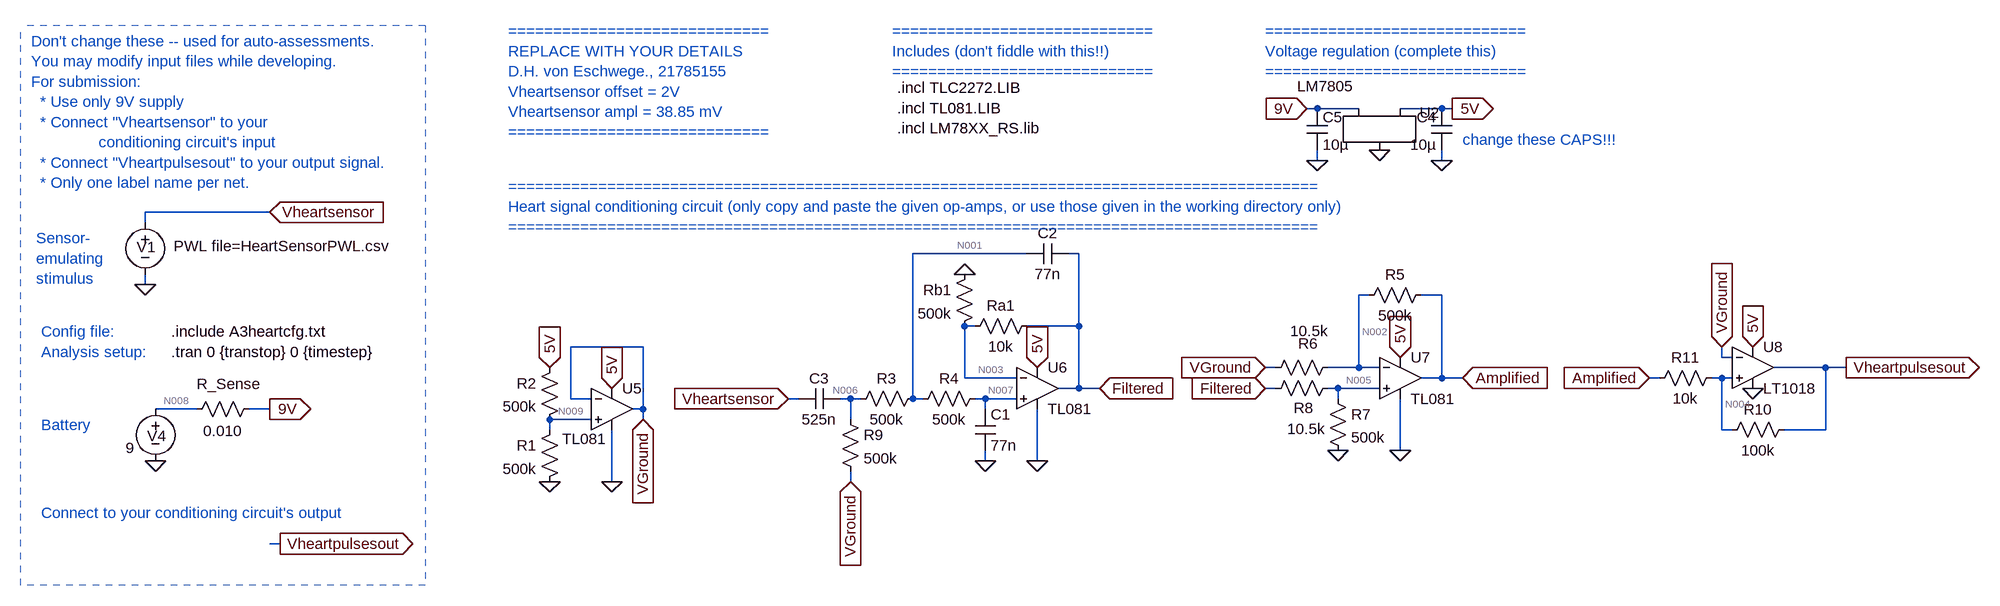
[diagram p0: schematic E344_A3_heart.asc]
E344_A3_heart.asc, the LTspice schematic file:
Version 4
SHEET 1 1824 680
WIRE -304 -1280 -320 -1280
WIRE -240 -1280 -304 -1280
WIRE -112 -1280 -176 -1280
WIRE -96 -1280 -112 -1280
WIRE -304 -1200 -304 -1216
WIRE -112 -1200 -112 -1216
WIRE -1920 -1120 -2112 -1120
WIRE -2112 -1104 -2112 -1120
WIRE -752 -1056 -928 -1056
WIRE -672 -1056 -688 -1056
WIRE -2112 -1008 -2112 -1024
WIRE -224 -992 -240 -992
WIRE -112 -992 -144 -992
WIRE -832 -944 -848 -944
WIRE -672 -944 -672 -1056
WIRE -672 -944 -752 -944
WIRE -1344 -912 -1456 -912
WIRE 320 -896 320 -912
WIRE 336 -896 320 -896
WIRE -368 -880 -384 -880
WIRE -240 -880 -240 -992
WIRE -240 -880 -288 -880
WIRE -208 -880 -240 -880
WIRE 480 -880 400 -880
WIRE 512 -880 480 -880
WIRE -848 -864 -848 -944
WIRE -768 -864 -848 -864
WIRE -112 -864 -112 -992
WIRE -112 -864 -144 -864
WIRE -80 -864 -112 -864
WIRE 224 -864 208 -864
WIRE 320 -864 304 -864
WIRE 336 -864 320 -864
WIRE -672 -848 -672 -944
WIRE -672 -848 -704 -848
WIRE -640 -848 -672 -848
WIRE -368 -848 -384 -848
WIRE -272 -848 -288 -848
WIRE -208 -848 -272 -848
WIRE -1456 -832 -1456 -912
WIRE -1424 -832 -1456 -832
WIRE -1104 -832 -1120 -832
WIRE -1024 -832 -1040 -832
WIRE -1008 -832 -1024 -832
WIRE -928 -832 -928 -1056
WIRE -912 -832 -928 -832
WIRE -816 -832 -832 -832
WIRE -768 -832 -816 -832
WIRE -272 -832 -272 -848
WIRE -2032 -816 -2096 -816
WIRE -1920 -816 -1952 -816
WIRE -1344 -816 -1344 -912
WIRE -1344 -816 -1360 -816
WIRE -816 -816 -816 -832
WIRE -1424 -800 -1488 -800
WIRE -1344 -800 -1344 -816
WIRE -1024 -800 -1024 -832
WIRE -1488 -784 -1488 -800
WIRE 320 -784 320 -864
WIRE 336 -784 320 -784
WIRE 480 -784 480 -880
WIRE 480 -784 416 -784
WIRE -176 -752 -176 -832
WIRE -816 -736 -816 -752
WIRE -736 -736 -736 -816
WIRE -1392 -704 -1392 -784
WIRE -1024 -704 -1024 -720
WIRE -1904 -608 -1920 -608
FLAG -2112 -1008 0
FLAG -1920 -1120 Vheartsensor
IOPIN -1920 -1120 In
FLAG -1920 -816 9V
IOPIN -1920 -816 Out
FLAG -2096 -736 0
FLAG -1904 -608 Vheartpulsesout
IOPIN -1904 -608 Out
FLAG -1488 -704 0
FLAG -1488 -880 5V
IOPIN -1488 -880 In
FLAG -1392 -704 0
FLAG -1392 -848 5V
IOPIN -1392 -848 In
FLAG -1344 -800 VGround
IOPIN -1344 -800 In
FLAG -736 -736 0
FLAG -816 -736 0
FLAG -848 -1024 0
FLAG -736 -880 5V
IOPIN -736 -880 In
FLAG -176 -752 0
FLAG -272 -752 0
FLAG -176 -896 5V
IOPIN -176 -896 In
FLAG 368 -912 5V
IOPIN 368 -912 In
FLAG 368 -848 0
FLAG -1024 -704 VGround
IOPIN -1024 -704 In
FLAG -640 -848 Filtered
IOPIN -640 -848 In
FLAG -384 -848 Filtered
IOPIN -384 -848 In
FLAG -80 -864 Amplified
IOPIN -80 -864 In
FLAG 208 -864 Amplified
IOPIN 208 -864 In
FLAG -384 -880 VGround
IOPIN -384 -880 In
FLAG 320 -912 VGround
IOPIN 320 -912 In
FLAG 512 -880 Vheartpulsesout
IOPIN 512 -880 Out
FLAG -320 -1280 9V
IOPIN -320 -1280 In
FLAG -208 -1216 0
FLAG -96 -1280 5V
IOPIN -96 -1280 Out
FLAG -304 -1200 0
FLAG -112 -1200 0
FLAG -1120 -832 Vheartsensor
IOPIN -1120 -832 In
SYMBOL voltage -2112 -1120 R0
WINDOW 123 0 0 Left 0
WINDOW 39 0 0 Left 0
WINDOW 3 44 52 Left 2
WINDOW 0 -13 54 Left 2
SYMATTR Value PWL file=HeartSensorPWL.csv
SYMATTR InstName V1
SYMBOL voltage -2096 -832 R0
WINDOW 123 24 44 Left 2
WINDOW 39 0 0 Left 0
WINDOW 3 -46 76 Left 2
WINDOW 0 -13 57 Left 2
SYMATTR Value 9
SYMATTR InstName V4
SYMBOL res -1936 -832 R90
WINDOW 0 -7 47 VBottom 2
WINDOW 3 34 56 VTop 2
SYMATTR InstName R_Sense
SYMATTR Value 0.010
SYMBOL res -1472 -800 M0
SYMATTR InstName R1
SYMATTR Value 500k
SYMBOL res -1472 -896 M0
SYMATTR InstName R2
SYMATTR Value 500k
SYMBOL res -912 -848 R90
WINDOW 0 0 56 VBottom 2
WINDOW 3 32 56 VTop 2
SYMATTR InstName R3
SYMATTR Value 500k
SYMBOL cap -832 -816 R0
SYMATTR InstName C1
SYMATTR Value 77n
SYMBOL res -816 -848 R90
WINDOW 0 0 56 VBottom 2
WINDOW 3 32 56 VTop 2
SYMATTR InstName R4
SYMATTR Value 500k
SYMBOL res -736 -960 R90
WINDOW 0 0 56 VBottom 2
WINDOW 3 32 56 VTop 2
SYMATTR InstName Ra1
SYMATTR Value 10k
SYMBOL res -832 -1040 M0
SYMATTR InstName Rb1
SYMATTR Value 500k
SYMBOL cap -688 -1072 R90
WINDOW 0 0 32 VBottom 2
WINDOW 3 32 32 VTop 2
SYMATTR InstName C2
SYMATTR Value 77n
SYMBOL res -128 -1008 R90
WINDOW 0 0 56 VBottom 2
WINDOW 3 32 56 VTop 2
SYMATTR InstName R5
SYMATTR Value 500k
SYMBOL res -272 -896 R90
WINDOW 0 -6 46 VBottom 2
WINDOW 3 -56 44 VTop 2
SYMATTR InstName R6
SYMATTR Value 10.5k
SYMBOL res -288 -848 R0
SYMATTR InstName R7
SYMATTR Value 500k
SYMBOL res -272 -864 R90
WINDOW 0 62 53 VBottom 2
WINDOW 3 63 49 VTop 2
SYMATTR InstName R8
SYMATTR Value 10.5k
SYMBOL cap -1040 -816 M270
WINDOW 0 32 32 VTop 2
WINDOW 3 0 32 VBottom 2
SYMATTR InstName C3
SYMATTR Value 525n
SYMBOL res -1040 -816 R0
SYMATTR InstName R9
SYMATTR Value 500k
SYMBOL res 432 -800 R90
WINDOW 0 0 56 VBottom 2
WINDOW 3 32 56 VTop 2
SYMATTR InstName R10
SYMATTR Value 100k
SYMBOL res 320 -880 R90
WINDOW 0 0 56 VBottom 2
WINDOW 3 32 56 VTop 2
SYMATTR InstName R11
SYMATTR Value 10k
SYMBOL opamp2 -736 -912 R0
SYMATTR InstName U6
SYMATTR Value TL081
SYMATTR SpiceModel TL081
SYMBOL opamp2 -176 -928 R0
SYMATTR InstName U7
SYMATTR Value TL081
SYMATTR SpiceModel TL081
SYMBOL LT1018 368 -880 R0
SYMATTR InstName U8
SYMBOL opamp2 -1392 -880 R0
WINDOW 3 -77 110 Left 2
SYMATTR Value TL081
SYMATTR InstName U5
SYMATTR SpiceModel TL081
SYMBOL LM7805 -208 -1264 R0
WINDOW 3 -83 -66 Top 2
SYMATTR InstName U2
SYMBOL cap -96 -1280 M0
WINDOW 0 24 13 Left 2
SYMATTR InstName C4
SYMATTR Value 10µ
SYMBOL cap -320 -1280 R0
WINDOW 0 24 13 Left 2
SYMATTR InstName C5
SYMATTR Value 10µ
TEXT -2072 -904 Left 2 !.tran 0 {transtop} 0 {timestep}
TEXT -2072 -936 Left 2 !.include A3heartcfg.txt
TEXT -2288 -1384 Left 2 ;Don't change these -- used for auto-assessments.\nYou may modify input files while developing.\nFor submission: \n  * Use only 9V supply \n  * Connect "Vheartsensor" to your \n               conditioning circuit's input\n  * Connect "Vheartpulsesout" to your output signal.\n  * Only one label name per net.
TEXT -2272 -936 Left 2 ;Config file:
TEXT -2272 -904 Left 2 ;Analysis setup:
TEXT -2272 -792 Left 2 ;Battery
TEXT -2280 -1080 Left 2 ;Sensor-\nemulating \nstimulus
TEXT -1552 -1400 Left 2 ;=============================\nREPLACE WITH YOUR DETAILS\nD.H. von Eschwege., 21785155\nVheartsensor offset = 2V\nVheartsensor ampl = 38.85 mV\n=============================
TEXT -1552 -1160 Left 2 ;==========================================================================================\nHeart signal conditioning circuit (only copy and paste the given op-amps, or use those given in the working directory only)\n==========================================================================================
TEXT -384 -1400 Left 2 ;=============================\nVoltage regulation (complete this)\n=============================
TEXT -952 -1312 Left 2 !.incl TLC2272.LIB\n.incl TL081.LIB\n.incl LM78XX_RS.lib
TEXT -2272 -656 Left 2 ;Connect to your conditioning circuit's output
TEXT -960 -1400 Left 2 ;=============================\nIncludes (don't fiddle with this!!)\n=============================
TEXT -80 -1232 Left 2 ;change these CAPS!!!
LINE Normal -2304 -544 -2304 -1408 1
LINE Normal -1680 -1408 -1680 -544 1
LINE Normal -1680 -544 -2304 -544 1
LINE Normal -1680 -1408 -2304 -1408 1

The netlist it stands for:
* E344_A3_heart.asc
V1 Vheartsensor 0 PWL file=HeartSensorPWL.csv
V4 N008 0 9
R_Sense 9V N008 0.010
R1 N009 0 500k
R2 5V N009 500k
R3 N001 N006 500k
C1 N007 0 77n
R4 N007 N001 500k
Ra1 Filtered N003 10k
Rb1 0 N003 500k
C2 Filtered N001 77n
R5 Amplified N002 500k
R6 N002 VGround 10.5k
R7 N005 0 500k
R8 N005 Filtered 10.5k
C3 N006 Vheartsensor 525n
R9 N006 VGround 500k
R10 Vheartpulsesout N004 100k
R11 N004 Amplified 10k
XU6 N007 N003 5V 0 Filtered TL081 TL081  ; pins In+ In- V+ V- OUT
XU7 N005 N002 5V 0 Amplified TL081 TL081  ; pins In+ In- V+ V- OUT
XU8 N004 VGround 5V 0 Vheartpulsesout LT1018  ; pins In+ In- V+ V- OUT
XU5 N009 VGround 5V 0 VGround TL081 TL081  ; pins In+ In- V+ V- OUT
XU2 9V 0 5V LM7805
C4 5V 0 10µ
C5 9V 0 10µ
.tran 0 {transtop} 0 {timestep}
.include A3heartcfg.txt
* Don't change these -- used for auto-assessments.
* You may modify input files while developing.
* For submission:
*   * Use only 9V supply
*   * Connect "Vheartsensor" to your
*                conditioning circuit's input
*   * Connect "Vheartpulsesout" to your output signal.
*   * Only one label name per net.
* Config file:
* Analysis setup:
* Battery
* Sensor-
* emulating
* stimulus
* =============================
* REPLACE WITH YOUR DETAILS
* D.H. von Eschwege., 21785155
* Vheartsensor offset = 2V
* Vheartsensor ampl = 38.85 mV
* =============================
* ==========================================================================================
* Heart signal conditioning circuit (only copy and paste the given op-amps, or use those given in the working directory only)
* ==========================================================================================
* =============================
* Voltage regulation (complete this)
* =============================
.incl TLC2272.LIB
.incl TL081.LIB
.incl LM78XX_RS.lib
* Connect to your conditioning circuit's output
* =============================
* Includes (don't fiddle with this!!)
* =============================
* change these CAPS!!!
.lib LTC1.lib
.backanno
.end

* Results of the author's LTspice run, read from the files saved beside the schematic
* Operating Point, zero values left out:
*   V(vheartsensor) = 2.007 V
*   V(n008) = 9 V
*   V(9v) = 9 V
*   V(n009) = 2.501 V
*   V(5v) = 5.003 V
*   V(n001) = 2.501 V
*   V(n006) = 2.501 V
*   V(n007) = 2.501 V
*   V(filtered) = 2.551 V
*   V(n003) = 2.501 V
*   V(amplified) = 2.381 V
*   V(n002) = 2.499 V
*   V(vground) = 2.501 V
*   V(n005) = 2.499 V
*   V(vheartpulsesout) = 26.56 mV
*   V(n004) = 2.167 V
*   I(R11) = -21.4 µA
*   I(R10) = -21.4 µA
*   I(R9) = -32.55 pA
*   I(R8) = -4.998 µA
*   I(R7) = 4.998 µA
*   I(R6) = -235.9 nA
*   I(R5) = -235.8 nA
*   I(Rb1) = -5.003 µA
*   I(Ra1) = 5.003 µA
*   I(R4) = -32.55 pA
*   I(R3) = -32.55 pA
*   I(R2) = 5.003 µA
*   I(R1) = 5.003 µA
*   I(R_sense) = -12.79 mA
*   I(V4) = -12.79 mA
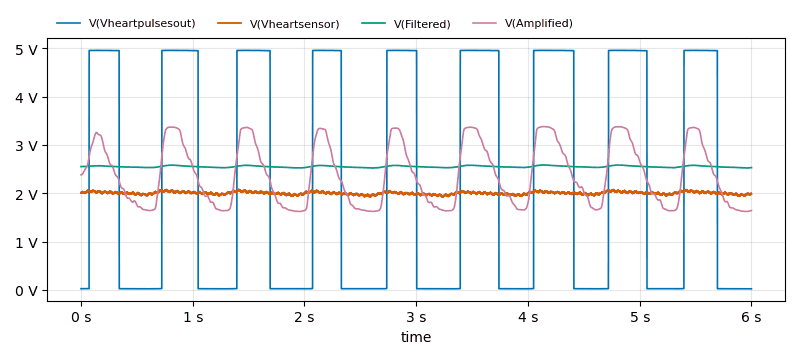
[diagram p1: Transient Analysis of E344_A3_heart.asc, plotted from the saved traces]
* Transient Analysis, 1 run:
*   V(Vheartpulsesout): min 24.16 mV, max 4.955 V, average 2.295 V, rms 3.362 V, last 24.21 mV
*   V(Vheartsensor): min 1.919 V, max 2.08 V, average 2.003 V, rms 2.003 V, last 1.981 V
*   V(Filtered): min 2.523 V, max 2.585 V, average 2.551 V, rms 2.551 V, last 2.53 V
*   V(Amplified): min 1.624 V, max 3.379 V, average 2.382 V, rms 2.466 V, last 1.643 V